# Altium project SDMIO.PrjPcb
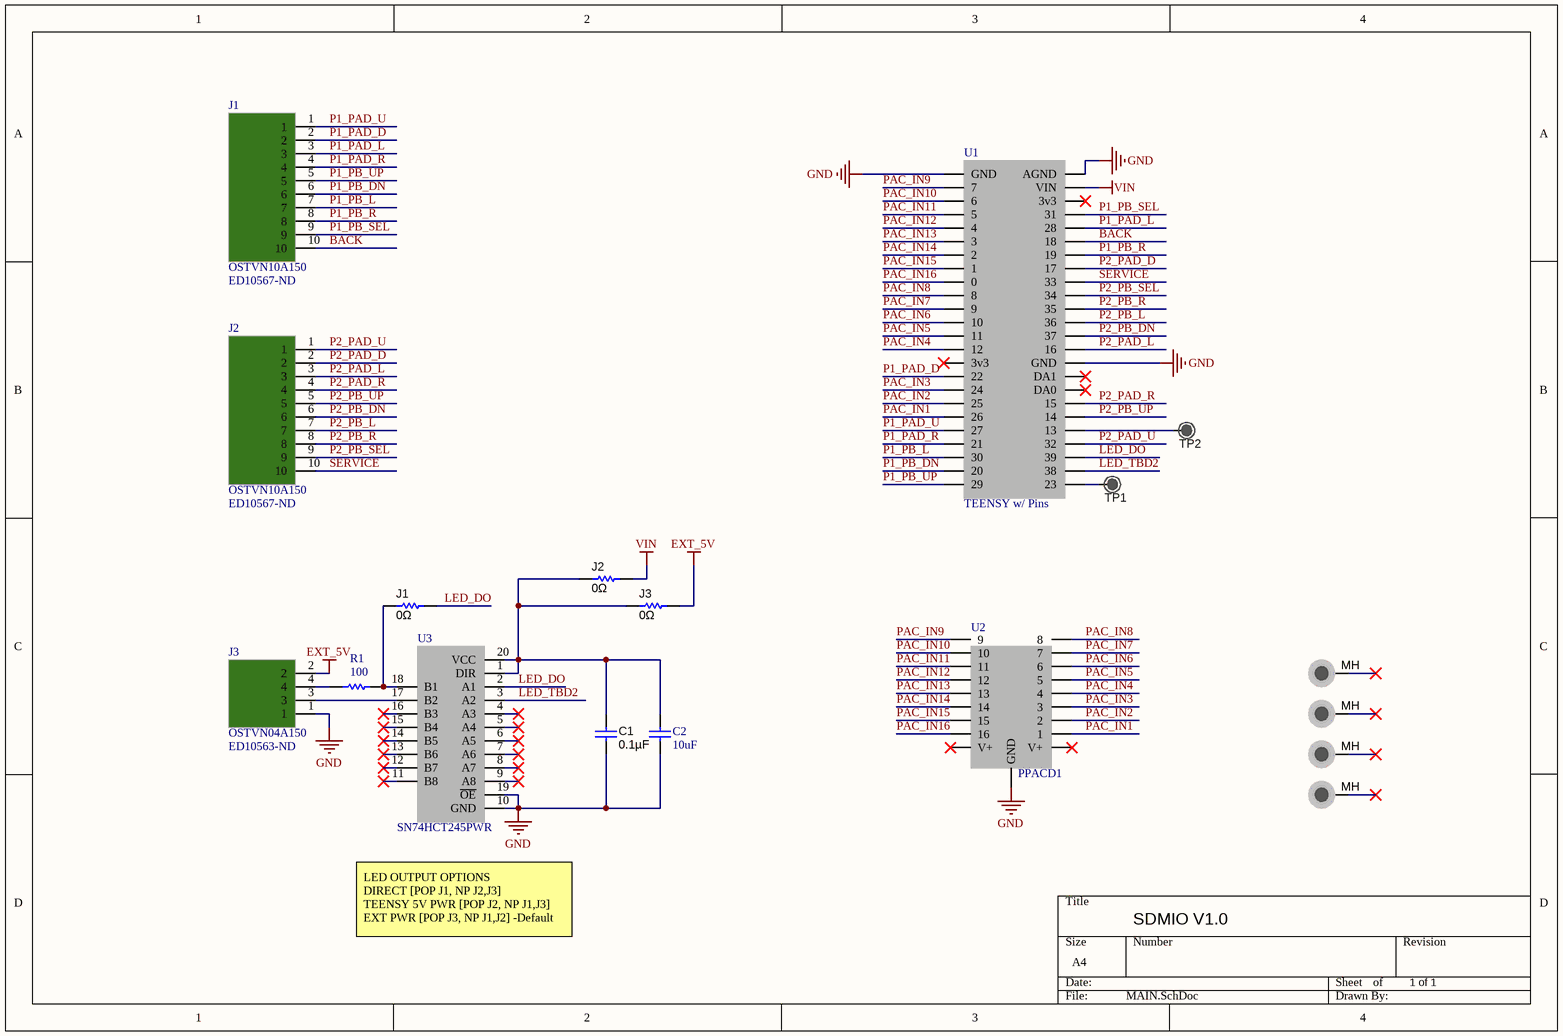
[diagram p0: MAIN.SchDoc]
1 sheet, 18 parts. Net scope: global (net labels, ports and power ports of the same name join across sheets).
Board file: SDMIO.PcbDoc

## Sheet MAIN.SchDoc
size A4

### Parts
(Parts that share a designator on the sheet are numbered #1, #2 ... from top to bottom, then left to right.)
C1  Capacitance: 0.1µF  [0603]  (hidden comment: GRM188R70J104KA01D)
C2  Capacitance: 10uF  [0603]  (hidden comment: LMK107BBJ106MALT)
J1#1  OSTVN10A150  Supplier Part Number 1: ED10567-ND  [OSTVN10A150]
J1#2  Tolerance: 0Ω  [0603]  (hidden comment: MCR03EZPJ000)
J2#1  OSTVN10A150  Supplier Part Number 1: ED10567-ND  [OSTVN10A150]
J2#2  Tolerance: 0Ω  [0603]  (hidden comment: MCR03EZPJ000)
J3#1  Tolerance: 0Ω  [0603]  (hidden comment: MCR03EZPJ000)
J3#2  OSTVN04A150  Supplier Part Number 1: ED10563-ND  [OSTVN4A150]
MH1  MH?  [4-40 LOOSE]  (value not drawn)
MH2  MH?  [4-40 LOOSE]  (value not drawn)
MH3  MH?  [4-40 LOOSE]  (value not drawn)
MH4  MH?  [4-40 LOOSE]  (value not drawn)
R1  Resistance: 100  [0603]  (hidden comment: SG73P1JTTD1000F)
TP1  Test Point  [TP]  (value not drawn)
TP2  Test Point  [TP]  (value not drawn)
U1  TEENSY w/ Pins  [TEENSY35]
U2  PPACD1  [PAC Drive]
U3  SN74HCT245PWR  [TSOP65P640X120-20N]

### Nets
EXT_5V: J3#1.2 J3#2.2
GND: C1.2 C2.1 J3#2.1 U1.AGND U1.GND U2.GND U3.10(GND) U3.19(~{OE})
VIN: J2#2.2 U1.VIN
BACK: J1#1.10 U1.18
LED_DO: J1#2.2 U1.39 U3.2(A1)
LED_TBD2: U1.38 U3.3(A2)
P1_PAD_D: J1#1.2 U1.22
P1_PAD_L: J1#1.3 U1.28
P1_PAD_R: J1#1.4 U1.21
P1_PAD_U: J1#1.1 U1.27
P1_PB_DN: J1#1.6 U1.20
P1_PB_L: J1#1.7 U1.30
P1_PB_R: J1#1.8 U1.19
P1_PB_SEL: J1#1.9 U1.31
P1_PB_UP: J1#1.5 U1.29
P2_PAD_D: J2#1.2 U1.17
P2_PAD_L: J2#1.3 U1.16
P2_PAD_R: J2#1.4 U1.15
P2_PAD_U: J2#1.1 U1.32
P2_PB_DN: J2#1.6 U1.37
P2_PB_L: J2#1.7 U1.36
P2_PB_R: J2#1.8 U1.35
P2_PB_SEL: J2#1.9 U1.34
P2_PB_UP: J2#1.5 U1.14
PAC_IN1: U1.26 U2.1
PAC_IN2: U1.25 U2.2
PAC_IN3: U1.24 U2.3
PAC_IN4: U1.12 U2.4
PAC_IN5: U1.11 U2.5
PAC_IN6: U1.10 U2.6
PAC_IN7: U1.9 U2.7
PAC_IN8: U1.8 U2.8
PAC_IN9: U1.7 U2.9
PAC_IN10: U1.6 U2.10
PAC_IN11: U1.5 U2.11
PAC_IN12: U1.4 U2.12
PAC_IN13: U1.3 U2.13
PAC_IN14: U1.2 U2.14
PAC_IN15: U1.1 U2.15
PAC_IN16: U1.0 U2.16
SERVICE: J2#1.10 U1.33
NetC1_1: C1.1 C2.2 J2#2.1 J3#1.1 U3.1(DIR) U3.20(VCC)
NetJ1#2_1: J1#2.1 R1.2 U3.18(B1)
NetJ3#2_3: J3#2.3 U3.17(B2)
NetJ3#2_4: J3#2.4 R1.1
NetTP1_1: TP1.1 U1.23
NetTP2_1: TP2.1 U1.13

Not connected (* = marked no-connect by the designer): MH1 MH*; MH2 MH*; MH3 MH*; MH4 MH*; U1 3v3* DA0* DA1*; U2 V+*; U3 4(A3)* 5(A4)* 6(A5)* 7(A6)* 8(A7)* 9(A8)* 11(B8)* 12(B7)* 13(B6)* 14(B5)* 15(B4)* 16(B3)*

### Notes on the sheet
- SDMIO V1.0
- LED OUTPUT OPTIONS
  DIRECT [POP J1, NP J2,J3]
  TEENSY 5V PWR [POP J2, NP J1,J3]
  EXT PWR [POP J3, NP J1,J2] -Default
- 1 of 1
- Project Name
- Project Varient
- Title:
- Date:
- Number:
- Sheet
- Time:
- of
- Size:
- Revision:
- A4
- File:

### Library data of the parts
C1 = 490-9730-1-ND: CAP CER 0.1UF 6.3V 10% X7R 0603; Manufacturer: Murata Electronics North America; Supplier 1: Digi-Key; Manufacturer Part Number: GRM188R70J104KA01D; RoHS: RoHS Compliant; Category: Capacitors; Stock 1: 25776; Pricing 1: 1=0.1, 10=0.061, 50=0.0332, 100=0.0281, 250=0.02296, 500=0.01964, 1000=0.0153 (USD); Packaging: Cut Tape (CT); Tolerance: ±10%; Voltage - Rated: 6.3V; Temperature Coefficient: X7R; Mounting Type: Surface Mount, MLCC; Operating Temperature: -55°C ~ 125°C; Applications: General Purpose; Ratings: -; Package / Case: 0603 (1608 Metric); Size / Dimension: 0.063" L x 0.031" W (1.60mm x 0.80mm); Height - Seated (Max): -; Thickness (Max): 0.035" (0.90mm); Lead Spacing: -; Features: -; Lead Style: -; ComponentLink1URL: http://www.murata.com/~/media/webrenewal/support/library/catalog/products/capacitor/mlcc/c02e.ashx; ComponentLink1Description: http://www.murata.com/~/media/webrenewal/support/library/catalog/products/capacitor/mlcc/c02e.ashx; Supplier Part Number 1: 490-9730-1-ND
C2 = 587-3258-1-ND: CAP CER 10UF 10V X5R 0603; Manufacturer: Taiyo Yuden; Tolerance: 20%; Supplier 1: Digi-Key; Manufacturer Part Number: LMK107BBJ106MALT; RoHS: Yes; Category: Ceramic Capacitors; Stock 1: 784962; Pricing 1: 1=0.20000, 10=0.14200, 50=0.08080, 100=0.06700, 500=0.04698, 1000=0.03889 (USD); Mount: Surface Mount; Case/Package: 0603; Case Code (Imperial): 0603; Case Code (Metric): 1608; Min Operating Temperature: -55°C; Max Operating Temperature: 85°C; Termination: SMD/SMT; Resistor Type: Ceramic; Voltage: 10V; Package Quantity: 1; Voltage Rating: 10V; Voltage Rating (DC): 10V; Packaging: Tape and Reel; Dielectric: X5R; Length: 1.6mm; Width: 0.8mm; Height: 0.8mm; Thickness: 0.035inch; Depth: 0.8mm; Radiation Hardening: No; REACH SVHC: Unknown; Lead Free: Lead Free; ComponentLink1URL: https://datasheet.ciiva.com/11596/lmk107bbj106malt-ss-11596989.pdf?src-supplier=Avnet; ComponentLink1Description: https://datasheet.ciiva.com/11596/lmk107bbj106malt-ss-11596989.pdf?src-supplier=Avnet; ComponentLink2URL: https://datasheet.ciiva.com/26872/getdatasheetpartid-637524-26872634.pdf?src-supplier=Verical; ComponentLink2Description: https://datasheet.ciiva.com/26872/getdatasheetpartid-637524-26872634.pdf?src-supplier=Verical; Supplier Part Number 1: 587-3258-1-ND
J1#1 J2#1 = OSTVN10A150: Conn Terminal Block 10 POS 2.54mm Solder ST Thru-Hole 6A; Manufacturer: On-Shore Technology; Plating: Brass,Steel; Number of Levels: 1; Number of Positions Per Level: 10; Voltage: 125V; Wire Gauge (Max): 30AWG; Wire Gauge (Min): 20AWG; Pitch: 0.1inch; Supplier 1: Digi-Key; Manufacturer Part Number: OSTVN10A150; RoHS: Yes; Category: Terminal Blocks; Stock 1: 4575; Pricing 1: 1=3.10000, 10=2.34500, 25=2.17360, 50=1.95440, 100=1.90680, 250=1.66844, 500=1.52544, 1000=1.38243, 5000=1.27120 (USD); Mount: Through Hole; Number of Pins: 10; Color: Green; Contact Plating: Brass; Housing Material: Thermoplastic; Min Operating Temperature: -30°C; Max Operating Temperature: 105°C; Packaging: Bulk; Current: 6A; Termination: Screw; Series: OSTVN; RoHS Compliant: Yes; ComponentLink1URL: https://datasheet.ciiva.com/826/ostvnxxa150-826427.pdf?src-supplier=Digi-Key; ComponentLink1Description: https://datasheet.ciiva.com/826/ostvnxxa150-826427.pdf?src-supplier=Digi-Key
J1#2 J2#2 J3#1 = RHM0.0GCT-ND: RES SMD 0.0 OHM JUMPER 1/10W; Manufacturer: Rohm Semiconductor; Resistance (Ohms): 0.0; Power (Watts): 0.1W, 1/10W; Supplier 1: Digi-Key; Manufacturer Part Number: MCR03EZPJ000; RoHS: RoHS Compliant; Category: Resistors; Stock 1: 1869772; Pricing 1: 1=0.1, 10=0.015, 25=0.0112, 100=0.0062, 250=0.00476, 500=0.0038, 1000=0.0028 (USD); Packaging: Cut Tape (CT); Composition: Thick Film; Features: -; Temperature Coefficient: -; Operating Temperature: -55°C ~ 155°C; Package / Case: 0603 (1608 Metric); Supplier Device Package: 0603 (1608 Metric); Size / Dimension: 0.063" L x 0.031" W (1.60mm x 0.80mm); Height: 0.022" (0.55mm); Number of Terminations: 2; ComponentLink1URL: http://rohmfs.rohm.com/en/products/databook/datasheet/passive/resistor/chip_resistor/mcr.pdf; ComponentLink1Description: http://rohmfs.rohm.com/en/products/databook/datasheet/passive/resistor/chip_resistor/mcr.pdf; Supplier Part Number 1: RHM0.0GCT-ND
J3#2 = OSTVN04A150: Conn Terminal Block 4 POS 2.54mm Solder ST Thru-Hole 6A; Manufacturer: On-Shore Technology; Plating: Brass,Steel; Number of Levels: 1; Number of Positions Per Level: 4; Voltage: 125V; Wire Gauge (Max): 30AWG; Wire Gauge (Min): 20AWG; Pitch: 0.1inch; Supplier 1: Digi-Key; Manufacturer Part Number: OSTVN04A150; RoHS: Yes; Category: Terminal Blocks; Stock 1: 22335; Pricing 1: 1=1.45000, 10=1.01800, 25=0.94920, 50=0.86140, 100=0.85760, 250=0.72420, 500=0.68608, 1000=0.60984, 5000=0.50820 (USD); Mount: Through Hole; Number of Pins: 4; Color: Green; Contact Plating: Brass; Housing Material: Thermoplastic; Min Operating Temperature: -30°C; Max Operating Temperature: 105°C; Packaging: Bulk; Current: 6A; Termination: Screw; Series: OSTVN; RoHS Compliant: Yes; ComponentLink1URL: https://datasheet.ciiva.com/823/ostvnxxa150-823966.pdf?src-supplier=Digi-Key; ComponentLink1Description: https://datasheet.ciiva.com/823/ostvnxxa150-823966.pdf?src-supplier=Digi-Key
MH1-MH4 = MH?: MOUNTING HOLE
R1 = 2019-SG73P1JTTD1000FCT-ND: RES 100 OHM 1% 1/3W 0603; Manufacturer: KOA Speer; Voltage Rating (DC): 50V; Power Rating: 200mW; Temperature Coefficient: 100ppm/°C; Supplier 1: Digi-Key; Manufacturer Part Number: SG73P1JTTD1000F; RoHS: Yes; Category: Chip SMD Resistors; Stock 1: 20051; Pricing 1: 1=0.15000, 10=0.13500, 100=0.05180, 1000=0.02277, 2500=0.01966 (USD); Case/Package: 0603; Number of Pins: 2; Case Code (Imperial): 0603; Case Code (Metric): 1608; Min Operating Temperature: -55°C; Max Operating Temperature: 155°C; Tolerance: 1%; Voltage Rating: 50V; Packaging: Tape and Reel; Resistor Type: Thick Film; Termination: SMD/SMT; Series: SG73; Resistance Tolerance: 1%; Width: 0.8mm; REACH SVHC: No SVHC; RoHS Compliant: Yes; ComponentLink1URL: https://datasheet.ciiva.com/5685/78338-5685709.pdf?src-supplier=Farnell; ComponentLink1Description: https://datasheet.ciiva.com/5685/78338-5685709.pdf?src-supplier=Farnell; ComponentLink2URL: https://datasheet.ciiva.com/5759/78338-5759199.pdf?src-supplier=Farnell; ComponentLink2Description: https://datasheet.ciiva.com/5759/78338-5759199.pdf?src-supplier=Farnell; ComponentLink3URL: https://datasheet.ciiva.com/5540/sg73-5540485.pdf?src-supplier=Mouser; ComponentLink3Description: https://datasheet.ciiva.com/5540/sg73-5540485.pdf?src-supplier=Mouser; ComponentLink4URL: https://datasheet.ciiva.com/7773/78338-7773478.pdf?src-supplier=Element14; ComponentLink4Description: https://datasheet.ciiva.com/7773/78338-7773478.pdf?src-supplier=Element14; ComponentLink5URL: https://datasheet.ciiva.com/7773/78338-7773479.pdf?src-supplier=Element14; ComponentLink5Description: https://datasheet.ciiva.com/7773/78338-7773479.pdf?src-supplier=Element14; Supplier Part Number 1: 2019-SG73P1JTTD1000FCT-ND
U1 = TEENSY35
U2 = PAC-DRIVE: Low-cost driver board for devices such as LEDs, solenoids, lamps etc
U3 = SN74HCT245PWR: Transceiver, Non-Inverting 1 Element 8 Bit per Element Push-Pull Output 20-TSSOP; Manufacturer: Texas Instruments; Min Supply Voltage: 4.5V; Max Supply Voltage: 5.5V; Number of Elements: 1; Direction: Bidirectional; Operating Supply Voltage: 5V; Propagation Delay: 74ns; Number of Channels: 8; High Level Output Current: -6mA; Low Level Output Current: 6mA; Logic Function: Transceiver,Inverting; Quiescent Current: 8uA; Supplier 1: Digi-Key; Manufacturer Part Number: SN74HCT245PWR; RoHS: Yes; Category: Logic Gates; Stock 1: 81828; Pricing 1: 1=0.54000, 10=0.46100, 25=0.43040, 100=0.34430, 250=0.31968, 500=0.27052, 1000=0.20903 (USD); Mount: Surface Mount; Case/Package: TSSOP; Number of Pins: 20; Weight: 0.002716oz; Contact Plating: Gold; Min Operating Temperature: -40°C; Max Operating Temperature: 85°C; Packaging: Tape and Reel; Package Quantity: 2000; Number of Bits per Element: 8; Number of Circuits: 8; Polarity: Non-Inverting; Turn-On Delay Time: 74ns; Number of Outputs: 8; Number of Bits: 8; Radiation Hardening: No; Lead Free: Lead Free; RoHS Compliant: Yes; REACH SVHC: No SVHC; ComponentLink1URL: https://datasheet.ciiva.com/27051/1008995-27051202.pdf?src-supplier=Jameco; ComponentLink1Description: https://datasheet.ciiva.com/27051/1008995-27051202.pdf?src-supplier=Jameco; ComponentLink2URL: https://datasheet.ciiva.com/15086/getdatasheetpartid-247086-15086443.pdf?src-supplier=Verical; ComponentLink2Description: https://datasheet.ciiva.com/15086/getdatasheetpartid-247086-15086443.pdf?src-supplier=Verical; ComponentLink3URL: https://datasheet.ciiva.com/41456/001016827-da-01-en-ic-bus-8bit-s-sn74hct245pwr-tssop-20-tid-41456682.pdf?src-supplier=Conrad; ComponentLink3Description: https://datasheet.ciiva.com/41456/001016827-da-01-en-ic-bus-8bit-s-sn74hct245pwr-tssop-20-tid-41456682.pdf?src-supplier=Conrad; ComponentLink4URL: https://datasheet.ciiva.com/28594/1835034-28594298.pdf?src-supplier=Element14; ComponentLink4Description: https://datasheet.ciiva.com/28594/1835034-28594298.pdf?src-supplier=Element14; ComponentLink5URL: https://datasheet.ciiva.com/46442/1835034-46442670.pdf?src-supplier=Element14; ComponentLink5Description: https://datasheet.ciiva.com/46442/1835034-46442670.pdf?src-supplier=Element14; ComponentLink6URL: https://datasheet.ciiva.com/1833/sn74hct245-1833932.pdf?src-supplier=Digi-Key; ComponentLink6Description: https://datasheet.ciiva.com/1833/sn74hct245-1833932.pdf?src-supplier=Digi-Key; ComponentLink7URL: https://datasheet.ciiva.com/1833/sn74hct245-1833931.pdf?src-supplier=Digi-Key; ComponentLink7Description: https://datasheet.ciiva.com/1833/sn74hct245-1833931.pdf?src-supplier=Digi-Key; ComponentLink8URL: https://datasheet.ciiva.com/1833/sn74hct245-1833933.pdf?src-supplier=Digi-Key; ComponentLink8Description: https://datasheet.ciiva.com/1833/sn74hct245-1833933.pdf?src-supplier=Digi-Key; Supplier Part Number 1: 296-8404-1-ND

## Assembly variants
DEFAULT: not fitted JMP1 JMP2 JMP?